# EAGLE schematic USB_GPIO_interface_V3 (EAGLE 6.6.0)
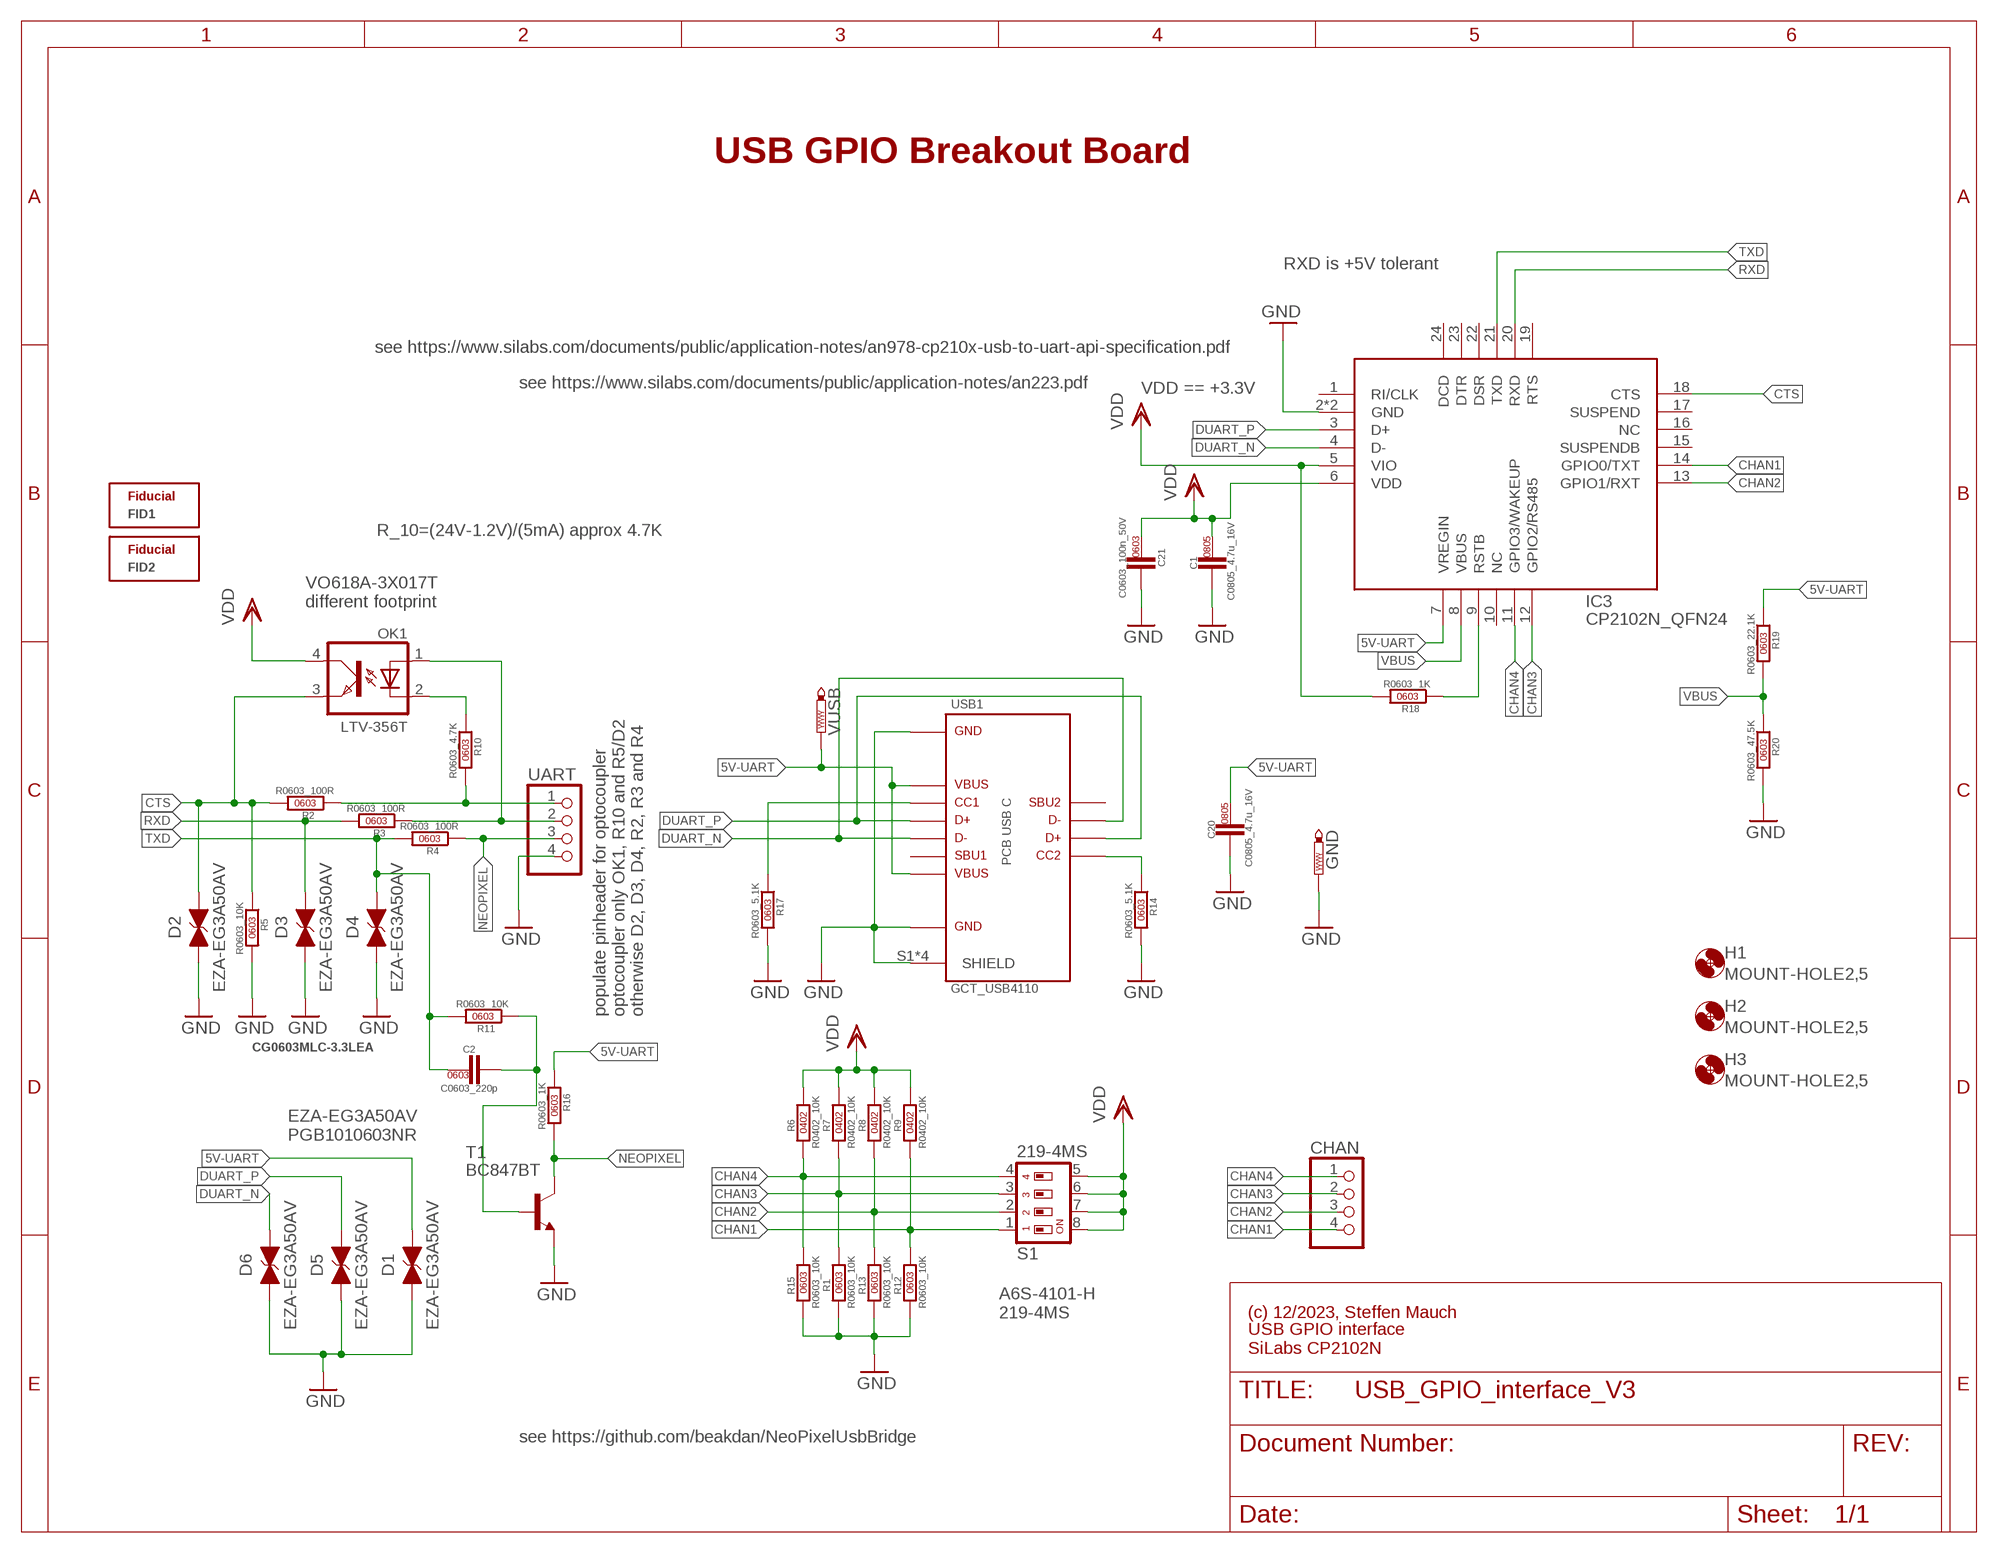
[diagram p0: schematic, sheet 1]

## Parts
C1  C0805_4.7u_16V  C_0805  [0805]
C2  C0603_220p  C_0603  [0603]
C20  C0805_4.7u_16V  C_0805  [0805]
C21  C0603_100n_50V  C_0603  [0603]
CHAN  PINHD-1X4MOLEX  [1X04_MOLEX]
D1  EZA-EG3A50AV  [TVS0603]
D2  EZA-EG3A50AV  [TVS0603]
D3  EZA-EG3A50AV  [TVS0603]
D4  EZA-EG3A50AV  [TVS0603]
D5  EZA-EG3A50AV  [TVS0603]
D6  EZA-EG3A50AV  [TVS0603]
FID1  FIDUCIAL-1MM  [FID-ROUND-1MM]
FID2  FIDUCIAL-1MM  [FID-ROUND-1MM]
GND  TESTPOINT0,8MM  [TESTPOINT-0.8MM]
H1  MOUNT-HOLE2,5  [2,5]
H2  MOUNT-HOLE2,5  [2,5]
H3  MOUNT-HOLE2,5  [2,5]
IC3  CP2102N_QFN24  [QFN24-4X4]
OK1  LTV-356T  [SMD4]
R1  R0603_10K  R0603_  [0603]
R2  R0603_100R  R0603_  [0603]
R3  R0603_100R  R0603_  [0603]
R4  R0603_100R  R0603_  [0603]
R5  R0603_10K  R0603_  [0603]
R6  R0402_10K  R0402_  [0402]
R7  R0402_10K  R0402_  [0402]
R8  R0402_10K  R0402_  [0402]
R9  R0402_10K  R0402_  [0402]
R10  R0603_4.7K  R0603_  [0603]
R11  R0603_10K  R0603_  [0603]
R12  R0603_10K  R0603_  [0603]
R13  R0603_10K  R0603_  [0603]
R14  R0603_5.1K  R0603_  [0603]
R15  R0603_10K  R0603_  [0603]
R16  R0603_1K  R0603_  [0603]
R17  R0603_5.1K  R0603_  [0603]
R18  R0603_1K  R0603_  [0603]
R19  R0603_22.1K  R0603_  [0603]
R20  R0603_47.5K  R0603_  [0603]
S1  219-4MS  [SMS-004]
T1  BC847BT  [SOT-523-3]
UART  PINHD-1X4MOLEX  [1X04_MOLEX]
USB1  GCT_USB4110  [GCT_USB4110]
VUSB  TESTPOINT0,8MM  [TESTPOINT-0.8MM]

## Nets
5V-UART: C20.1 D1.2 IC3.7(VREGIN) R16.1 R19.1 USB1.A4/B9(A4) USB1.B4/A9(A9) VUSB.P$1(TP)
CHAN1: CHAN.4 IC3.14(GPIO0/TXT) R9.1 R12.2 S1.1
CHAN2: CHAN.3 IC3.13(GPIO1/RXT) R8.1 R13.2 S1.2
CHAN3: CHAN.2 IC3.12(GPIO2/RS485) R1.2 R7.1 S1.3
CHAN4: CHAN.1 IC3.11(GPIO3/WAKEUP) R6.1 R15.2 S1.4
CTS: D2.2 IC3.18(CTS) OK1.3(E) R2.2 R5.1
DUART_N: D6.2 IC3.4(D-) USB1.A7 USB1.B7
DUART_P: D5.2 IC3.3(D+) USB1.A6 USB1.B6
GND: C1.2 C20.2 C21.2 D1.1 D2.1 D3.1 D4.1 D5.1 D6.1 GND.P$1(TP) IC3.2(GND) IC3.EXP(GND) R1.1 R5.2 R12.1 R13.1 R14.2 R15.1 R17.2 R20.2 T1.2(E) UART.4 USB1.A1/B12(A1) USB1.B!/A12(A12) USB1.S1(SHIELD) USB1.S2(SHIELD) USB1.S3(SHIELD) USB1.S4(SHIELD)
N$2: OK1.2(K) R10.1
N$3: C2.2 R11.1 T1.1(B)
N$4: R2.1 R10.2 UART.1
N$5: OK1.1(A) R3.1 UART.2
N$10: IC3.9(RSTB) R18.1
N$16: R17.1 USB1.A5
N$17: R14.1 USB1.B5
NEOPIXEL: R4.1 R16.2 T1.3(C) UART.3
RXD: D3.2 IC3.20(RXD) R3.2
TXD: C2.1 D4.2 IC3.21(TXD) R4.2 R11.2
VBUS: IC3.8(VBUS) R19.2 R20.1
VDD: C1.1 C21.1 IC3.5(VIO) IC3.6(VDD) OK1.4(C) R6.2 R7.2 R8.2 R9.2 R18.2 S1.5 S1.6 S1.7 S1.8
Unconnected: IC3.1(RI/CLK) IC3.10(NC) IC3.15(SUSPENDB) IC3.16(NC) IC3.17(SUSPEND) IC3.19(RTS) IC3.22(DSR) IC3.23(DTR) IC3.24(DCD) USB1.A8 USB1.B8

## Notes on the sheet
- USB GPIO Breakout Board
- RXD is +5V tolerant
- see https://www.silabs.com/documents/public/application-notes/an978-cp210x-usb-to-uart-api-specification.pdf
- see https://www.silabs.com/documents/public/application-notes/an223.pdf
- VDD == +3.3V
- R_10=(24V-1.2V)/(5mA) approx 4.7K
- VO618A-3X017T
  different footprint
- populate pinheader for optocoupler
  optocoupler only OK1, R10 and R5/D2
  otherwise D2, D3, D4, R2, R3 and R4
- CG0603MLC-3.3LEA
- EZA-EG3A50AV
  PGB1010603NR
- A6S-4101-H
  219-4MS
- (c) 12/2023, Steffen Mauch
- USB GPIO interface
  SiLabs CP2102N
- see https://github.com/beakdan/NeoPixelUsbBridge

## Library data of the parts
C1 C20 = HR:C_0805: Kondensator 0805 Bauform 0805 by trigerion; MF: generic
C2 C21 = HR:C_0603: Kondensator 0603 Bauform 0603 by trigerion; MF: generic
CHAN UART = librarySM:PINHD-1X4: PIN HEADER; MF: JST; MPN: B4B-XH-A
D1-D6 = librarySM:EZA-EG3A50AV; MF: Panasonic; MPN: EZA-EG3A50AV
FID1 FID2 = librarySM:FIDUCIAL; BOM_IGNORE: YES
GND VUSB = librarySM:TESTPOINT; BOM_IGNORE: YES
H1-H3 = librarySM:MOUNT-HOLE: MOUNTING HOLE with drill center marker; BOM_IGNORE: YES
IC3 = librarySM:CP2102N_QFN24; MF: Silicon Labs; MPN: CP2102N-A02-GQFN24
OK1 = HR:LTV-356T: Optokoppler Isolierspannung: 3750 Vrms Uceo: 200mV Strom If d. 50mA:; DIGIKEY: 160-1337-1-ND; MF: LITEON; MOUSER: 859-LTV-356T; MPN: LTV-356T; REICHELT: LTV 356T-SMD; RS-COMPONENTS: 691-2079
R1-R5 R10-R20 = HR:R0603_: R 0603 Std Bauform 0603 size 1,6 mm 0,8 mm Toleranz 1% Spannung 50V Leistung 100mW Tempkoeff. 100ppm/°C by Trigerion; MF: generic
R6-R9 = HR:R0402_: R 0402 Std Bauform 0402 size 1,1 mm 0,5 mm Toleranz 1% Spannung 50V Leistung 62,5mW Tempkoeff. 100ppm/°C by trigerion; MF: generic
S1 = librarySM:219-4MS; MF: CTS Components; MPN: 219-4MS
T1 = librarySM:BC847BT
USB1 = librarySM:GCT_USB4110

## Net classes
2 48V: width 1 mm, drill 0.3 mm, clearance 0.4 mm to class 0, clearance 0.4 mm to class 1, clearance 0.4 mm
5 POWER: width 0.254 mm, clearance 0.254 mm